# EAGLE schematic test-module (EAGLE 5.11)
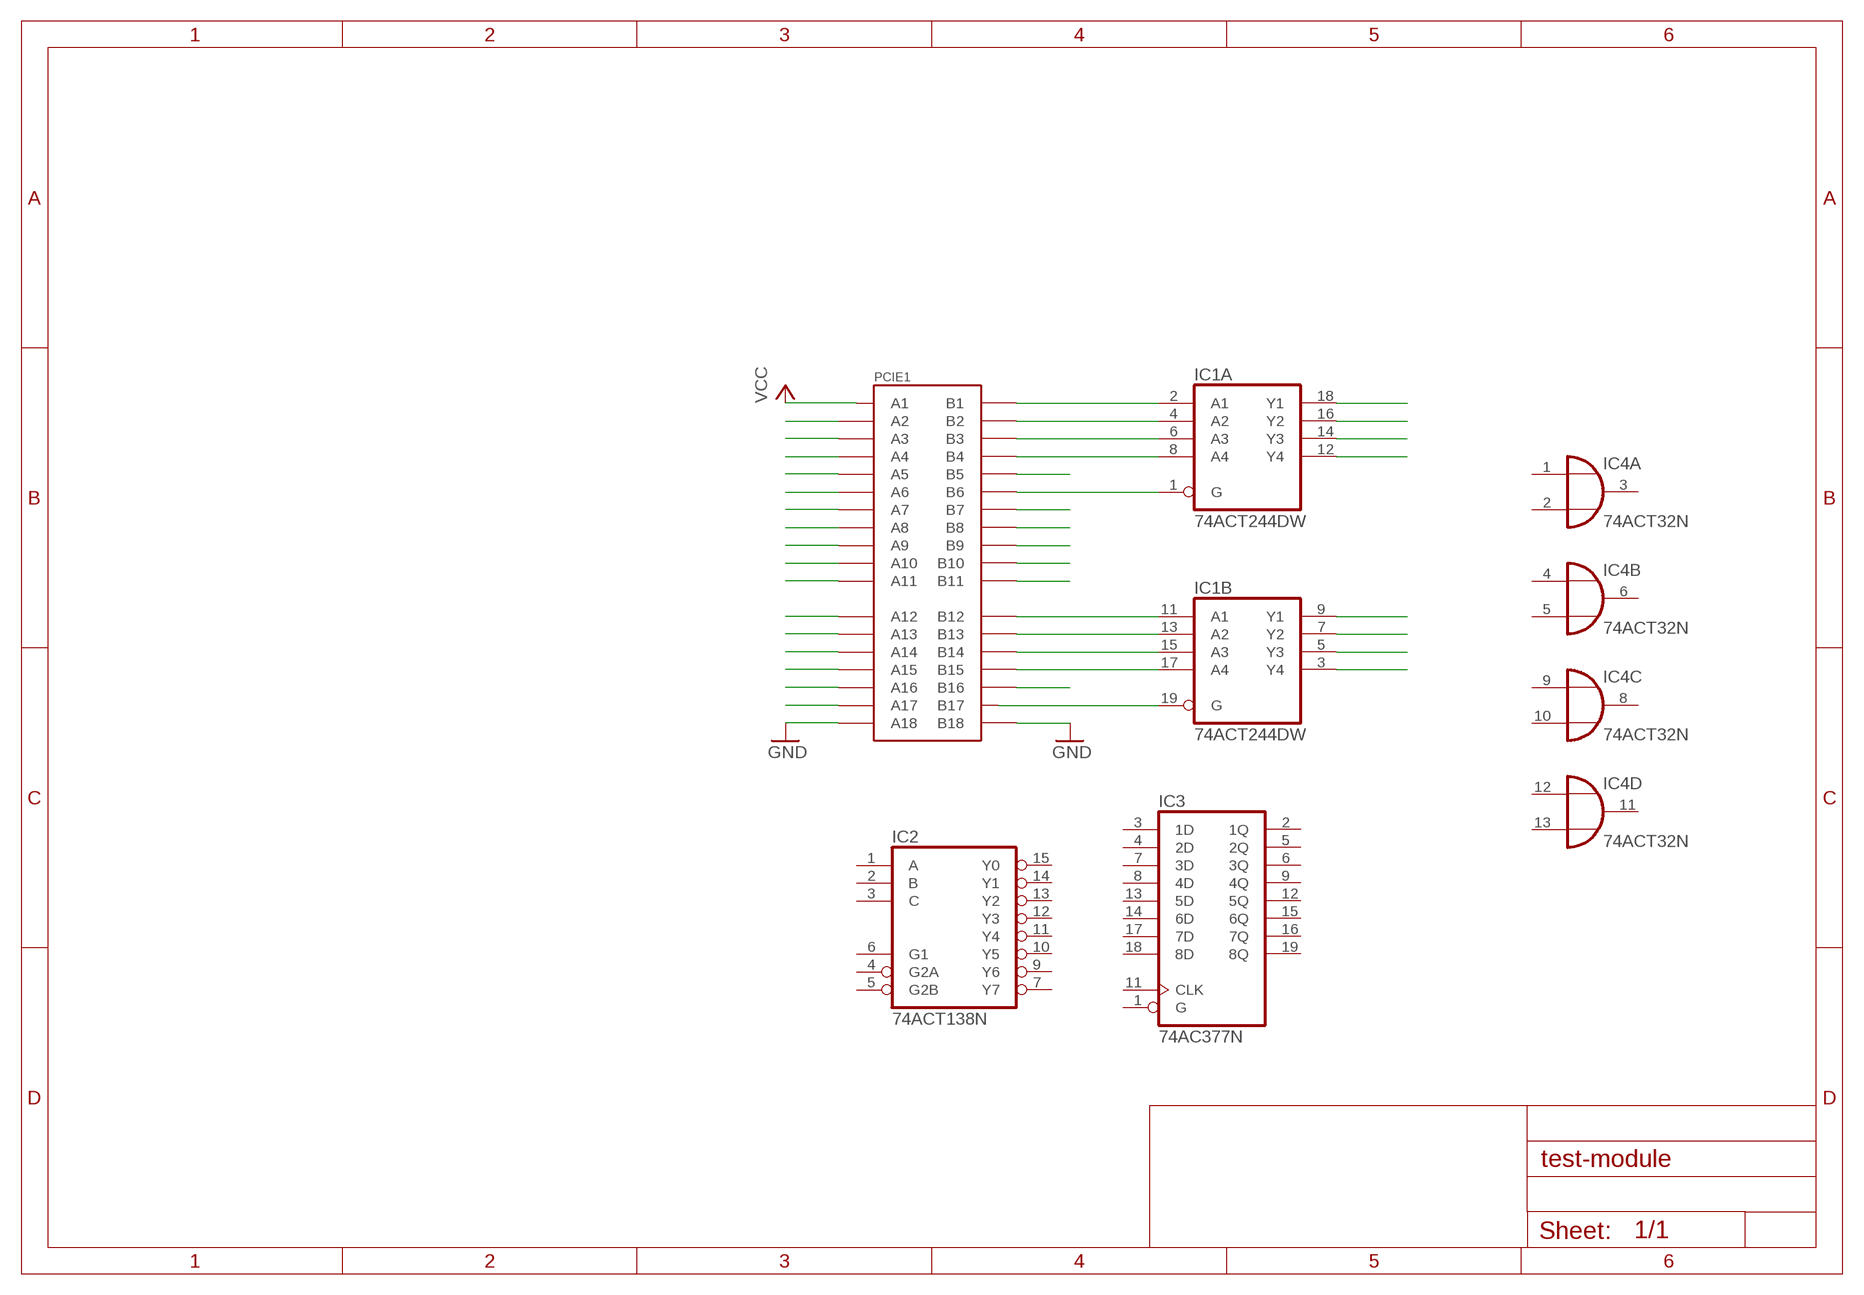
[diagram p0: schematic, sheet 1]

## Parts
IC1  74ACT244DW  [SO20W]
IC2  74ACT138N  [DIL16]
IC3  74AC377N  [DIL20]
IC4  74ACT32N  [DIL14]
PCIE1  PCIE-36-EDGE  [PCIE-36-EDGE]

## Nets
GND: PCIE1.A18 PCIE1.B18
N$1: IC1.2(A:A1) PCIE1.B1
N$2: IC1.4(A:A2) PCIE1.B2
N$3: IC1.6(A:A3) PCIE1.B3
N$4: IC1.8(A:A4) PCIE1.B4
N$5: PCIE1.B5
N$6: IC1.1(A:G) PCIE1.B6
N$7: PCIE1.B7
N$8: PCIE1.B8
N$9: PCIE1.B9
N$10: PCIE1.B10
N$11: PCIE1.B11
N$12: IC1.11(B:A1) PCIE1.B12
N$13: IC1.13(B:A2) PCIE1.B13
N$14: IC1.15(B:A3) PCIE1.B14
N$15: IC1.17(B:A4) PCIE1.B15
N$16: PCIE1.B16
N$17: IC1.19(B:G) PCIE1.B17
N$20: PCIE1.A17
N$21: PCIE1.A16
N$22: PCIE1.A15
N$23: PCIE1.A14
N$24: PCIE1.A13
N$25: PCIE1.A12
N$27: PCIE1.A2
N$28: PCIE1.A3
N$29: PCIE1.A4
N$30: PCIE1.A5
N$31: PCIE1.A6
N$32: PCIE1.A7
N$33: PCIE1.A8
N$34: PCIE1.A9
N$35: PCIE1.A10
N$36: PCIE1.A11
N$37: IC1.18(A:Y1)
N$38: IC1.16(A:Y2)
N$39: IC1.14(A:Y3)
N$40: IC1.12(A:Y4)
N$41: IC1.9(B:Y1)
N$42: IC1.7(B:Y2)
N$43: IC1.5(B:Y3)
N$44: IC1.3(B:Y4)
VCC: PCIE1.A1
Unconnected: IC2.1(A) IC2.2(B) IC2.3(C) IC2.4(G2A) IC2.5(G2B) IC2.6(G1) IC2.7(Y7) IC2.9(Y6) IC2.10(Y5) IC2.11(Y4) IC2.12(Y3) IC2.13(Y2) IC2.14(Y1) IC2.15(Y0) IC3.1(G) IC3.2(1Q) IC3.3(1D) IC3.4(2D) IC3.5(2Q) IC3.6(3Q) IC3.7(3D) IC3.8(4D) IC3.9(4Q) IC3.11(CLK) IC3.12(5Q) IC3.13(5D) IC3.14(6D) IC3.15(6Q) IC3.16(7Q) IC3.17(7D) IC3.18(8D) IC3.19(8Q) IC4.1(A:I0) IC4.2(A:I1) IC4.3(A:O) IC4.4(B:I0) IC4.5(B:I1) IC4.6(B:O) IC4.8(C:O) IC4.9(C:I0) IC4.10(C:I1) IC4.11(D:O) IC4.12(D:I0) IC4.13(D:I1)

## Power pins joined to a net without a drawn wire
GND: IC1.10(P:GND) IC2.8(GND) IC3.10(GND) IC4.7(P:GND)
VCC: IC1.20(P:VCC) IC2.16(VCC) IC3.20(VCC) IC4.14(P:VCC)

## Library data of the parts
IC1 = 74xx-eu:74*244: Octal BUFFER and LINE DRIVER, 3-state
IC2 = 74xx-eu:74*138: 3-line to 8-line DECODER/DEMULTIPLEXER
IC3 = 74xx-eu:74*377: Octal D type FLIP FLOP, enable
IC4 = 74xx-eu:74*32: Quad 2-input OR gate
PCIE1 = jt-con-pcie:PCIE-36-*: PCI-E 36-way connectors